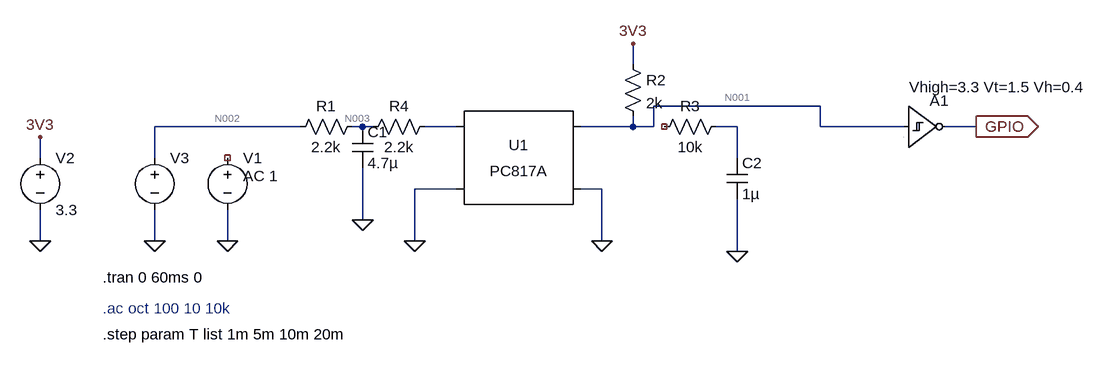
[diagram p0: schematic opto_input_alt.asc]
opto_input_alt.asc, the LTspice schematic file:
Version 4
SHEET 1 1428 680
WIRE 688 -32 688 -64
WIRE 976 32 720 32
WIRE 176 64 -48 64
WIRE 272 64 256 64
WIRE 288 64 272 64
WIRE 416 64 368 64
WIRE 688 64 688 48
WIRE 688 64 608 64
WIRE 720 64 720 32
WIRE 720 64 688 64
WIRE 848 64 816 64
WIRE 976 64 976 32
WIRE 1104 64 976 64
WIRE 1216 64 1168 64
WIRE -224 112 -224 80
WIRE -48 112 -48 64
WIRE 848 112 848 64
WIRE 416 160 352 160
WIRE 640 160 608 160
WIRE 272 208 272 128
WIRE -224 240 -224 192
WIRE -48 240 -48 192
WIRE 64 240 64 192
WIRE 352 240 352 160
WIRE 640 240 640 160
WIRE 848 256 848 176
FLAG 64 240 0
FLAG 352 240 0
FLAG 640 240 0
FLAG -224 240 0
FLAG 688 -64 3V3
FLAG -224 80 3V3
FLAG 1216 64 GPIO
IOPIN 1216 64 Out
FLAG 848 256 0
FLAG -48 240 0
FLAG 272 208 0
SYMBOL voltage 64 96 R0
WINDOW 3 24 96 Invisible 2
WINDOW 123 24 44 Left 2
WINDOW 39 0 0 Left 0
SYMATTR Value AC 1
SYMATTR Value2 AC 1
SYMATTR InstName V1
SYMBOL Optos\\PC817A 512 112 R0
SYMATTR InstName U1
SYMBOL res 272 48 R90
WINDOW 0 0 56 VBottom 2
WINDOW 3 32 56 VTop 2
SYMATTR InstName R1
SYMATTR Value 2.2k
SYMBOL voltage -224 96 R0
WINDOW 123 0 0 Left 0
WINDOW 39 0 0 Left 0
SYMATTR InstName V2
SYMATTR Value 3.3
SYMBOL res 672 -48 R0
SYMATTR InstName R2
SYMATTR Value 2k
SYMBOL cap 832 112 R0
SYMATTR InstName C2
SYMATTR Value 1µ
SYMBOL res 832 48 R90
WINDOW 0 0 56 VBottom 2
WINDOW 3 32 56 VTop 2
SYMATTR InstName R3
SYMATTR Value 10k
SYMBOL voltage -48 96 R0
WINDOW 3 24 96 Invisible 2
WINDOW 123 0 0 Left 0
WINDOW 39 0 0 Left 0
SYMATTR Value PULSE(0 12 10ms 0 0 {T} 100ms 1)
SYMATTR InstName V3
SYMBOL Digital\\schmtinv 1104 0 R0
WINDOW 3 9 3 Left 2
SYMATTR Value Vhigh=3.3 Vt=1.5 Vh=0.4
SYMATTR InstName A1
SYMBOL res 384 48 R90
WINDOW 0 0 56 VBottom 2
WINDOW 3 32 56 VTop 2
SYMATTR InstName R4
SYMATTR Value 2.2k
SYMBOL cap 256 64 R0
SYMATTR InstName C1
SYMATTR Value 4.7µ
TEXT -128 296 Left 2 !.tran 0 60ms 0
TEXT -128 344 Left 2 ;.ac oct 100 10 10k
TEXT -128 384 Left 2 !.step param T list 1m 5m 10m 20m

The netlist it stands for:
* opto_input_alt.asc
V1 NC_01 0 AC 1 AC 1
XU1 N004 0 N001 0 PC817 Igain=1m
R1 N003 N002 2.2k
V2 3V3 0 3.3
R2 3V3 N001 2k
C2 N005 0 1µ
R3 N005 NC_02 10k
V3 N002 0 PULSE(0 12 10ms 0 0 {T} 100ms 1)
A1 N001 0 0 0 0 GPIO 0 0 SCHMITT Vhigh=3.3 Vt=1.5 Vh=0.4
R4 N004 N003 2.2k
C1 N003 0 4.7µ
.tran 0 60ms 0
* .ac oct 100 10 10k
.step param T list 1m 5m 10m 20m
.lib PC817.sub
.backanno
.end

* Results of the author's LTspice run, read from the files saved beside the schematic
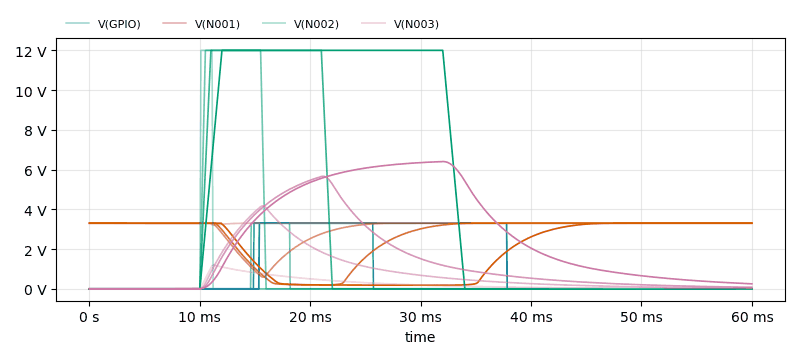
[diagram p1: Transient Analysis of opto_input_alt.asc, plotted from the saved traces]
* Transient Analysis, 4 runs:
*   V(GPIO) [t=0.001]: min 0 V, max 0 V, average 0 V, rms 0 V, last 0 V
*   V(GPIO) [t=0.005]: min 0 V, max 3.3 V, average 194.2 mV, rms 800.6 mV, last 0 V
*   V(GPIO) [t=0.01]: min 0 V, max 3.3 V, average 594.8 mV, rms 1.401 V, last 0 V
*   V(GPIO) [t=0.02]: min 0 V, max 3.3 V, average 1.234 V, rms 2.018 V, last 0 V
*   V(N001) [t=0.001]: min 3.203 V, max 3.3 V, average 3.298 V, rms 3.298 V, last 3.3 V
*   V(N001) [t=0.005]: min 590.4 mV, max 3.3 V, average 3.046 V, rms 3.107 V, last 3.3 V
*   V(N001) [t=0.01]: min 192.2 mV, max 3.3 V, average 2.677 V, rms 2.889 V, last 3.3 V
*   V(N001) [t=0.02]: min 179.2 mV, max 3.3 V, average 2.071 V, rms 2.497 V, last 3.3 V
*   V(N002) [t=0.001]: min 0 V, max 12 V, average 220 mV, rms 1.602 V, last 0 V
*   V(N002) [t=0.005]: min 0 V, max 12 V, average 1.1 V, rms 3.578 V, last 0 V
*   V(N002) [t=0.01]: min 0 V, max 12 V, average 2.2 V, rms 5.061 V, last 0 V
*   V(N002) [t=0.02]: min 0 V, max 12 V, average 4.4 V, rms 7.156 V, last 0 V
*   V(N003) [t=0.001]: min 0 V, max 1.201 V, average 212.5 mV, rms 359.7 mV, last 10.42 mV
*   V(N003) [t=0.005]: min 0 V, max 4.173 V, average 756 mV, rms 1.303 V, last 37.26 mV
*   V(N003) [t=0.01]: min 0 V, max 5.662 V, average 1.362 V, rms 2.196 V, last 76.9 mV
*   V(N003) [t=0.02]: min 0 V, max 6.406 V, average 2.534 V, rms 3.497 V, last 249.5 mV